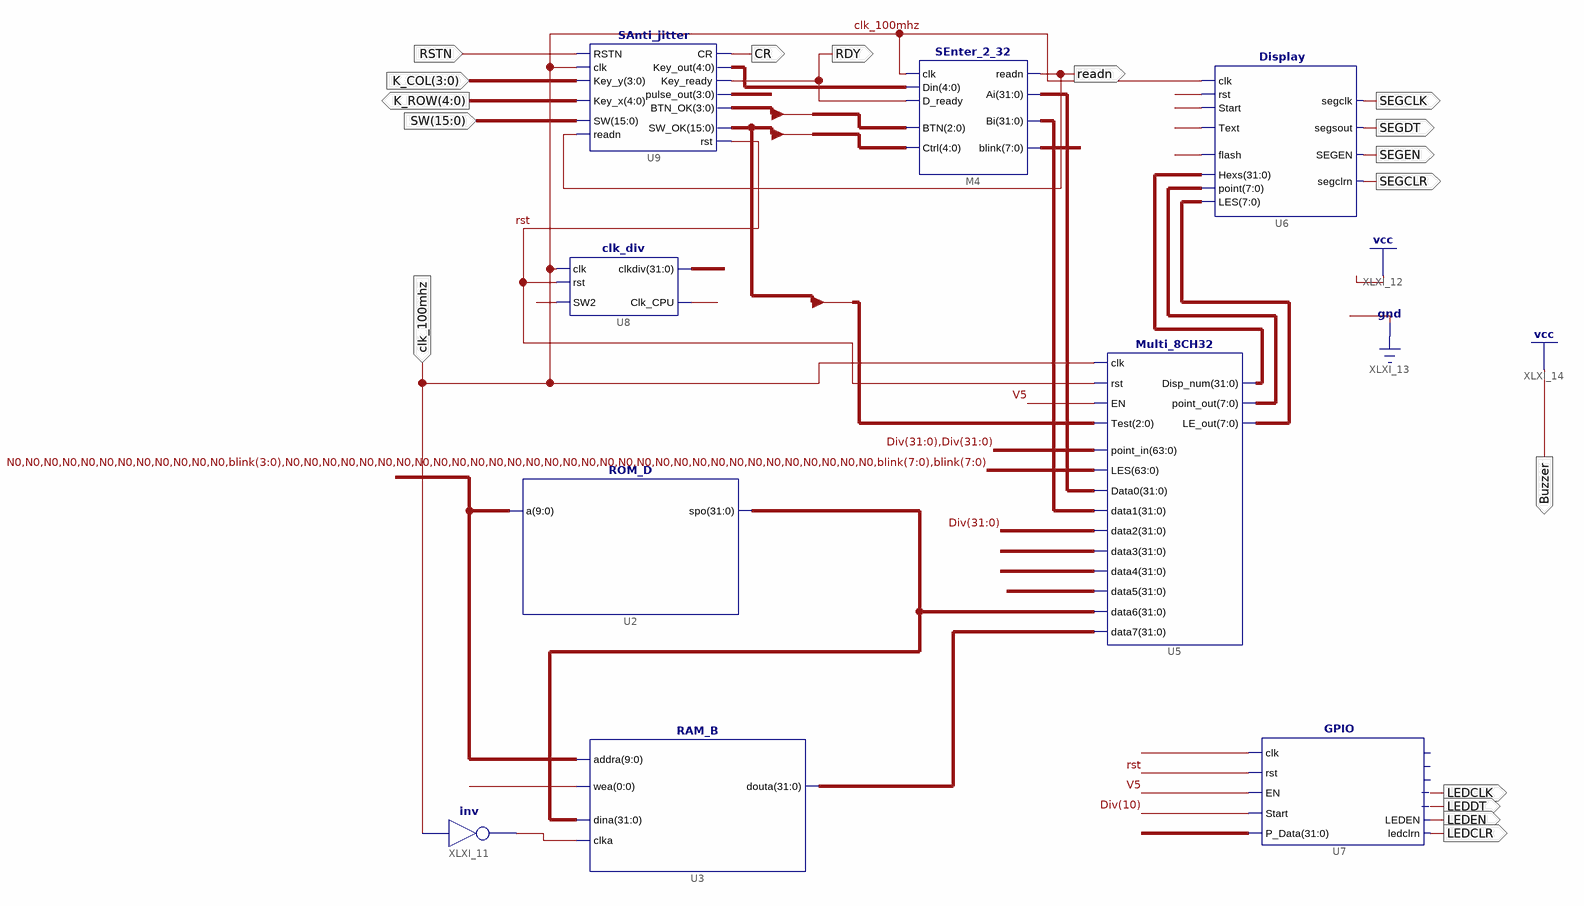
[diagram p0: schematic sheet 1]
// Xilinx ISE schematic OExp02_IO.sch (kintex7) as structural Verilog: 9 symbols, 17 ports
module OExp02_IO (
  input  RSTN,
  input  [3:0] K_COL,
  input  [15:0] SW,
  input  clk_100mhz,
  output [4:0] K_ROW,
  output CR,
  output RDY,
  output readn,
  output SEGCLK,
  output SEGDT,
  output SEGEN,
  output SEGCLR,
  output LEDCLK,
  output LEDDT,
  output LEDEN,
  output LEDCLR,
  output Buzzer
);

  wire Clk_CPU, rst, XLXN_10;
  wire [3:0] BTN_OK, Pulse;
  wire [4:0] XLXN_12;
  wire [7:0] blink, LE_out, point_out;
  wire [15:0] SW_OK;
  wire [31:0] Ai, Bi, Disp_num, Div, XLXN_47, XLXN_48, XLXN_49, XLXN_56, XLXN_57;

  SAnti_jitter U9 (
    .SW(SW), .readn(readn), .Key_y(K_COL), .Key_x(K_ROW), .RSTN(RSTN), .clk(clk_100mhz), .Key_out(XLXN_12),
    .Key_ready(RDY), .CR(CR), .rst(rst), .SW_OK(SW_OK), .pulse_out(Pulse), .BTN_OK(BTN_OK));
  clk_div U8 (.rst(rst), .clk(clk_100mhz), .SW2(SW_OK[2]), .clkdiv(Div), .Clk_CPU(Clk_CPU));
  SEnter_2_32 M4 (
    .readn(readn), .Ai(Ai), .Bi(Bi), .blink(blink), .Din(XLXN_12), .D_ready(RDY), .clk(clk_100mhz),
    .Ctrl({SW_OK[7:5], SW_OK[15], SW_OK[0]}), .BTN(BTN_OK[2:0]));
  Display U6 (
    .LES(LE_out), .SEGEN(SEGEN), .segsout(SEGDT), .segclrn(SEGCLR), .point(point_out), .Hexs(Disp_num),
    .Text(SW_OK[0]), .flash(Div[25]), .segclk(SEGCLK), .clk(clk_100mhz), .rst(rst), .Start(Div[10]));
  Multi_8CH32 U5 (
    .Test(SW_OK[7:5]), .point_in({Div, Div}), .EN(1'b1), .clk(clk_100mhz), .rst(rst),
    .LES({{12{1'b0}}, blink[3:0], {32{1'b0}}, blink, blink}), .Data0(Ai), .data1(Bi), .data2(Div),
    .data3(XLXN_47), .data4(XLXN_48), .data5(XLXN_49), .data6(XLXN_56), .data7(XLXN_57),
    .point_out(point_out), .LE_out(LE_out), .Disp_num(Disp_num));
  GPIO U7 (
    .clk(clk_100mhz), .P_Data({SW[13:0], SW_OK, 2'b00}), .rst(rst), .EN(1'b1), .Start(Div[10]),
    .ledclk(LEDCLK), .ledclrn(LEDCLR), .LEDEN(LEDEN), .ledsout(LEDDT));  // open: GPIOf0, LED_out, counter_set
  RAM_B U3 (.addra({{5{1'b0}}, SW[3], Div[27:24]}), .clka(XLXN_10), .wea(SW_OK[4]), .dina(XLXN_56), .douta(XLXN_57));
  ROM_D U2 (.a({{5{1'b0}}, SW[3], Div[27:24]}), .spo(XLXN_56));
  not XLXI_11 (XLXN_10, clk_100mhz);

  assign Buzzer = 1'b1;
endmodule
